# EAGLE schematic PM (EAGLE 9.6.2)
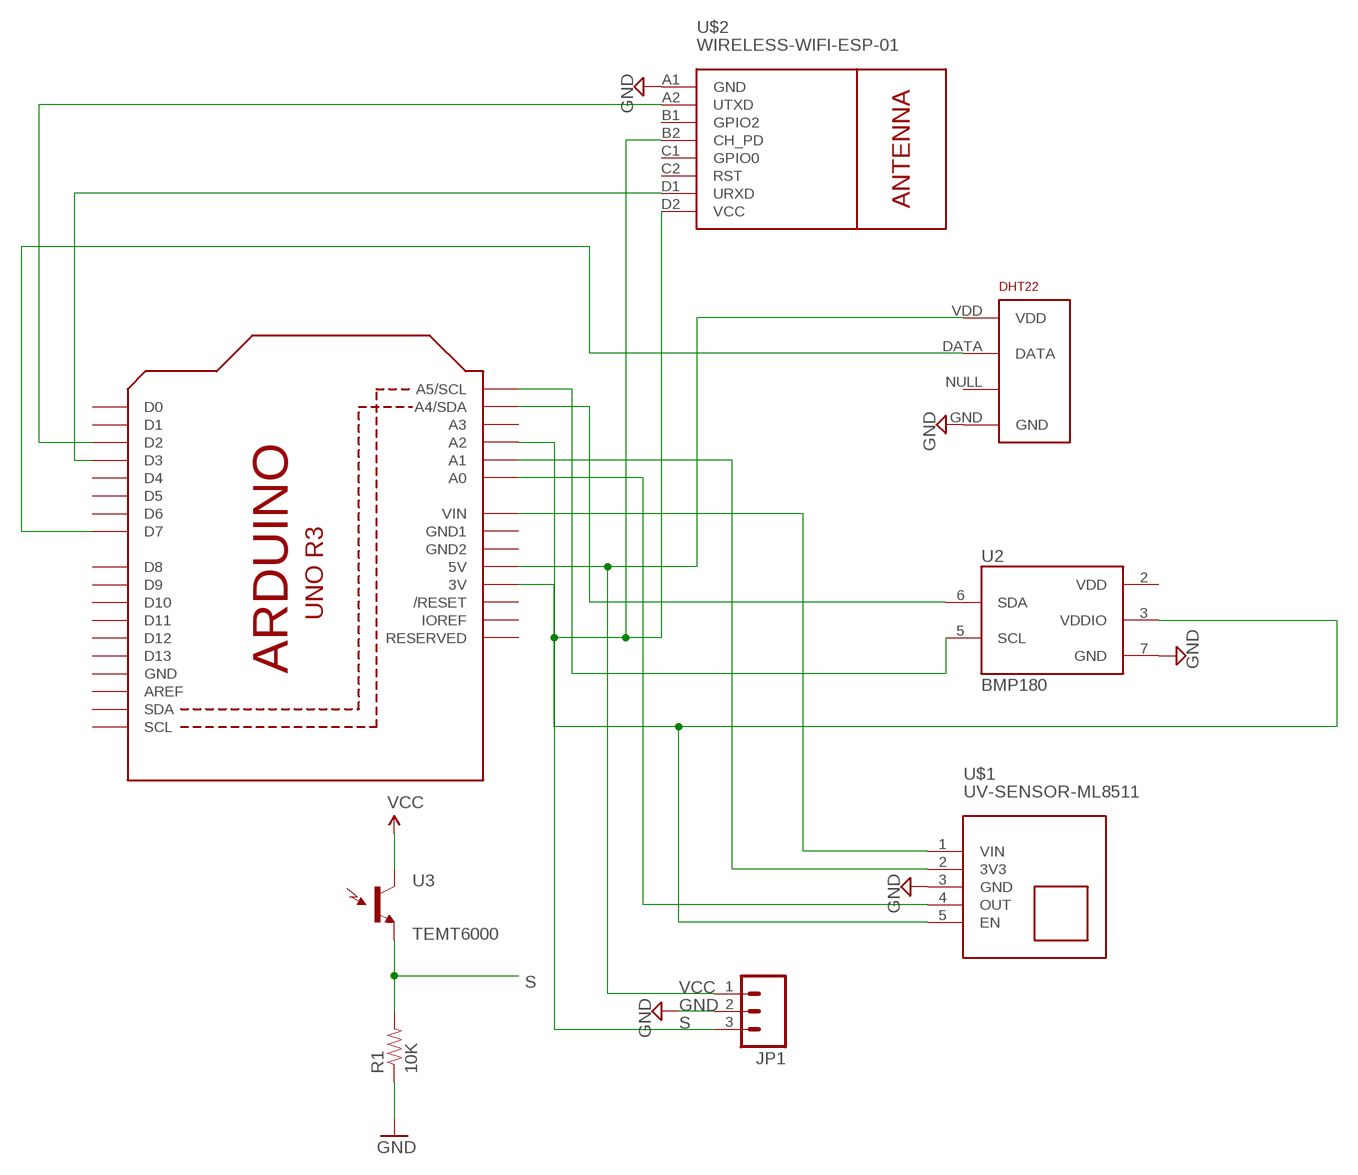
[diagram p0: schematic, sheet 1]

## Parts
DHT22  RHT03_DHT-22_AM2302  [RHT03_DHT-22]
JP1  M03PTH  [1X03]
R1  10K  RESISTOR0402-RES  [0402-RES]
U1  ARDUINOR3-DIMENSION  [ARDUINOR3]
U2  BMP180  [BMP180]
U3  TEMT6000  [TEMT6000-SEN]
U$1  UV-SENSOR-ML8511  [UV-SENSOR-ML8511]
U$2  WIRELESS-WIFI-ESP-01  [WIRELESS-WIFI-ESP-01]

## Nets
3V3: U1.3V U2.3(VDDIO) U$1.5(EN) U$2.B2(CH_PD) U$2.D2(VCC)
GND: DHT22.GND JP1.2 R1.1 U2.7(GND) U$1.3(GND) U$2.A1(GND)
N$1: U1.D2 U$2.A2(UTXD)
N$2: DHT22.DATA U1.D7
N$3: U1.D3 U$2.D1(URXD)
N$4: U1.A4(A4/SDA) U2.6(SDA)
N$5: U1.A5(A5/SCL) U2.5(SCL)
N$6: U1.A0 U$1.4(OUT)
N$7: U1.A1 U$1.2(3V3)
N$8: U1.VIN U$1.1(VIN)
S: JP1.3 R1.2 U1.A2 U3.EMITTER(E1)
VCC: DHT22.VDD JP1.1 U1.5V U3.COLLECTOR(C1)
Unconnected: DHT22.NULL U1.A3 U1.AREF U1.D0 U1.D1 U1.D4 U1.D5 U1.D6 U1.D8 U1.D9 U1.D10 U1.D11 U1.D12 U1.D13 U1.IOREF U1.RESERVED U1.RESET(/RESET) U1.SCL U1.SDA U$2.B1(GPIO2) U$2.C1(GPIO0) U$2.C2(RST)

## Power pins joined to a net without a drawn wire
GND: U1.GND
GND1: U1.GND1
GND2: U1.GND2
VDD: U2.2(VDD)

## Library data of the parts
DHT22 = RHT03_DHT-22_AM2302:RHT03_DHT-22_AM2302: RHT03 / DHT-22 / AM2302 Packages and symbol for the RHT03 / DHT-22 relative humidity and temperature sensor. Note: The AM2302 is a wired version of the DHT-22 which typically requires less clearance and is thus provided as a separate package.; PROD_ID: SEN-10167
JP1 = SparkFun:M03: Header 3 Standard 3-pin 0.1" header. Use with straight break away headers (SKU : PRT-00116), right angle break away headers (PRT-00553), swiss pins (PRT-00743), machine pins (PRT-00117), and female headers (PRT-00115). Molex polarized connector foot print use with SKU : PRT-08232 with associated crimp pins and housings.
R1 = SparkFun:RESISTOR: Resistor Basic schematic elements and footprints for 0603, 1206, and PTH 1/10th watt (small) resistors.
U1 = adafruit:ARDUINOR3: This is a new object for the new Arduino R3 - with extra pins that you may want to use (such as IOref, and duplicated A4/A5
U2 = BMP180:BMP180: BOSCH BMP180 DIGITAL BAROMETRIC PRESSURE SENSOR Web page: http://www.bosch-sensortec.com/en/homepage/products_3/environmental_sensors_1/bmp180_1/bmp180 Datasheet: http://ae-bst.resource.bosch.com/media/products/dokumente/bmp180/BST-BMP180-DS000-09.pdf The BMP180 is the function compatible successor of the BMP085, a new generation of high precision digital pressure sensors for consumer applications. The ultra-low power, low voltage electronics of the BMP180 is optimized for use in mobile phones, PDAs, GPS navigation devices and outdoor equipment. With a low altitude noise of merely 0.25m at fast conversion time, the BMP180 offers superior performance. The I2C interface allows for easy system integration with a microcontroller. The BMP180 is based on piezo-resistive technology for EMC robustness, high accuracy and linearity as well as long term stability. Key features: - Temperature measurement included - I2C interface - Fully calibrated - Pb-free, halogen-free and RoHS compliant, - MSL 1 Basic specs: Pressure range: 300 to 1100hPa (+9000m to -500m relating to sea level) Supply voltage: 1.8 to 3.6V (VDD), 1.62V to 3.6V (VDDIO) Package: LGA package with metal lid Small footprint: 3.6mm x 3.8mm Super-flat: 0.93mm height Low power: 5µA at 1 sample / sec. in standard mode Low noise: 0.06hPa (0.5m) in ultra low power mode, 0.02hPa (0.17m) advanced resolution mode Typical applications: - Enhancement of GPS navigation (dead-reckoning, slope detection, etc.) - In- and out-door navigation - Leisure and sports - Weather forecast - Vertical velocity indication (rise/sink speed)
U3 = SparkFun:TEMT6000: Ambient Light Sensor Simple light detection sensor. Output varies with light intensity input. Spark Fun Electronics SKU : COM-08348
U$1 = FG44LCAJ6QQLD7R:UV-SENSOR-ML8511: UV Sensor based on ML8511 device ML8511 user's guide is available here: https://learn.sparkfun.com/tutorials/ml8511-uv-sensor-hookup-guide/using-the-ml8511 ML8511 datasheet is available here: https://www.mcs.anl.gov/research/projects/waggle/downloads/datasheets/lightsense/ml8511.pdf Click here to find device on ebay.com <http://www.ebay.com/sch/ml8511+module>
U$2 = FG44LCAJ6QQLD7R:WIRELESS-WIFI-ESP-01: Wireless Wi-Fi ESP-01 Module based on ESP8266 chip Click here to find device on ebay.com <http://www.ebay.com/sch/esp8266+esp+01+transceiver>